# Altium schematic sheet RS485_Interface.SchDoc
size A3; DocumentNumber: 4; SheetNumber: 4; SheetTotal: 11
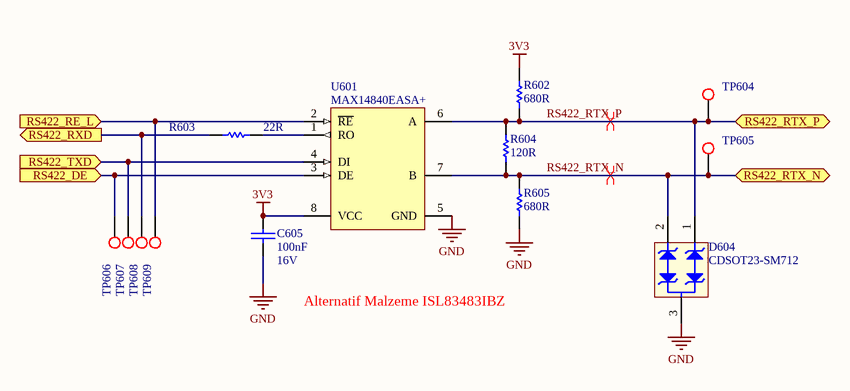
[diagram p0: RS485_Interface.SchDoc]

## Parts
C605  Operating Voltage: 16V  [CAPC1005X06N]  (hidden comment: 100nF)
D604  CDSOT23-SM712  [SOT95P230X117-3N]
R602  680R  [RESC1005X04N]
R603  22R  [RESC1005X04N]
R604  120R  [RESC1005X04N]
R605  680R  [RESC1005X04N]
TP604  AEMT-C00S-1000-0000  [TP100]  (value not drawn)
TP605  AEMT-C00S-1000-0000  [TP100]  (value not drawn)
TP606  AEMT-C00S-1000-0000  [TP100]  (value not drawn)
TP607  AEMT-C00S-1000-0000  [TP100]  (value not drawn)
TP608  AEMT-C00S-1000-0000  [TP100]  (value not drawn)
TP609  AEMT-C00S-1000-0000  [TP100]  (value not drawn)
U601  MAX14840EASA+  [SOIC127P600X175-8N]

## Ports
RS422_DE (in), RS422_RE_L (in), RS422_RTX_N (bidir), RS422_RTX_P (bidir), RS422_RXD (out), RS422_TXD (in)

## Nets
3V3: C605.1 R602.2 U601.8(VCC)
GND: C605.2 D604.3 R605.1 U601.5(GND)
RS422_DE: TP606.1 U601.3(DE) ; port RS422_DE
RS422_RE_L: TP609.1 U601.2(~{RE}) ; port RS422_RE_L
RS422_RTX_N: D604.2 R604.1 R605.2 TP605.1 U601.7(B) ; port RS422_RTX_N
RS422_RTX_P: D604.1 R602.1 R604.2 TP604.1 U601.6(A) ; port RS422_RTX_P
RS422_RXD: R603.1 TP608.1 ; port RS422_RXD
RS422_TXD: TP607.1 U601.4(DI) ; port RS422_TXD
NetR603_2: R603.2 U601.1(RO)

## Layout directives
differential pair: RS422_RTX_N, RS422_RTX_P

## Notes on the sheet
- Alternatif Malzeme ISL83483IBZ
- Title
- Size:
- Date:
- A3
- Number:
- Time:
- Revision:
- Sheet
- of
- File:

## Library data of the parts
C605 = ACC7-2100-S241-0000: CAP, CER, X7R, 100nF, %10, 16V, 0402; Manufacturer: Murata; Manufacturer Part Number: GRM155R71C104KA88D; CR: 000049; Requested by: MU; Lead Finish: Pb Free; Material: Ceramic, X7R; Definition Date: 14.08.2012; Revision Date: *; Price: *; Supplier: *; Supplier Part Number: *; DS: 000049; Operating Temp: -55 to 125 C; Storage Temp: -55 to 125 C; Status: Active; Package Reference: EIA 0402, Metric 1005; Component Type: Capacitor; Footprint Type: SMD; Published by: MU; ESR: *; FR: *; Value: 100nF
D604 = AS1H-A17M-SI20-0000: Diode, TVS, 7V-12V, 400W, CDSOT23-SM712, SOT23; Manufacturer: Bourns; CR: 449; DS: 000450; Lead Finish: Pb Free; Published by: MU; Requested by: NK; Price: *; Manufacturer Part Number: CDSOT23-SM712; Definition Date: 11.12.2014; Footprint Type: SMD; JEDEC Code: *; Operating Temp: -55°C to 150°C; Package Reference: SOT23; Revision Date: *; Status: Active; Storage Temp: -55°C to 150°C; Supplier: *; Supplier Part Number: *; Component Type: DIODE; Forward Voltage: *; Reverse Voltage: 7V-12V; Value: CDSOT23-SM712
R602 R605 = AR19-2680-S2B2-0000: RES, E24, Thick Film, SMD, 680R, 1%, 0.1W, 0402; Manufacturer: Panasonic; Manufacturer Part Number: ERJ-2RKF6800X; CR: DS00073; Requested by: MU; Lead Finish: Pb Free; Max. Operating Voltage: 50V; Definition Date: 16.08.2012; Revision Date: *; Price: *; Supplier: *; Supplier Part Number: *; DS: DS00073; Operating Temp: -55 to 155 C; Storage Temp: -55 to 155 C; Status: Active; Package Reference: EIA 0402, Metric 1005; Component Type: Resistor; Footprint Type: SMD; Published by: MU; JEDEC Code: *; Material: Thick Film; ESR: *; FR: *; Power Rating: 0.1W; Value: 680R
R603 = AR19-1220-S2B2-0000: RES, E24, Thick Film, SMD, 22R, 1%, 0.1W, 0402; Manufacturer: Panasonic; Manufacturer Part Number: ERJ-2RKF22R0X; CR: DS00073; Requested by: MU; Lead Finish: Pb Free; Max. Operating Voltage: 50V; Definition Date: 16.08.2012; Revision Date: *; Price: *; Supplier: *; Supplier Part Number: *; DS: DS00073; Operating Temp: -55 to 155 C; Storage Temp: -55 to 155 C; Status: Active; Package Reference: EIA 0402, Metric 1005; Component Type: Resistor; Footprint Type: SMD; Published by: MU; JEDEC Code: *; Material: Thick Film; ESR: *; FR: *; Power Rating: 0.1W; Value: 22R
R604 = AR19-2120-S2B2-0000: RES, E24, Thick Film, SMD, 120R, 1%, 0.1W, 0402; Manufacturer: Panasonic; Manufacturer Part Number: ERJ-2RKF1200X; CR: DS00073; Requested by: MU; Lead Finish: Pb Free; Max. Operating Voltage: 50V; Definition Date: 16.08.2012; Revision Date: *; Price: *; Supplier: *; Supplier Part Number: *; DS: DS00073; Operating Temp: -55 to 155 C; Storage Temp: -55 to 155 C; Status: Active; Package Reference: EIA 0402, Metric 1005; Component Type: Resistor; Footprint Type: SMD; Published by: MU; JEDEC Code: *; Material: Thick Film; ESR: *; FR: *; Power Rating: 0.1W; Value: 120R
TP604-TP609 = AEMT-C00S-1000-0000: Test Point, Circular, 1mm; Text: TEST_POINT
U601 = AT45-0000-SM50-1120: IC, Interface, Transceiver, RS-485 Half-Dublex, 3.3V, 40Mbps, MAX14840EASA+, SOIC-8; Manufacturer: MAXIM; CR: 175; DS: 000271; Requested by: NK; Lead Finish: Pb Free; Published by: IS; JEDEC Code: MO-012-AA; Revision Date: 13.08.2013; Supplier: *; Supplier Part Number: *; Storage Temp: -65°C to 150°C; Operating Temp: -40°C to 125°C; Definition Date: 01.07.2013; Price: *; Status: Active; Component Type: IC; Package Reference: SOIC-8; Footprint Type: SMD; Manufacturer Part Number: MAX14840EASA+; FR: *; Value: MAX14840EASA+